# Altium schematic sheet WL_RF_SWITCH.SchDoc
size 420 x 297 mm; SheetNumber: 6; SheetTotal: 9
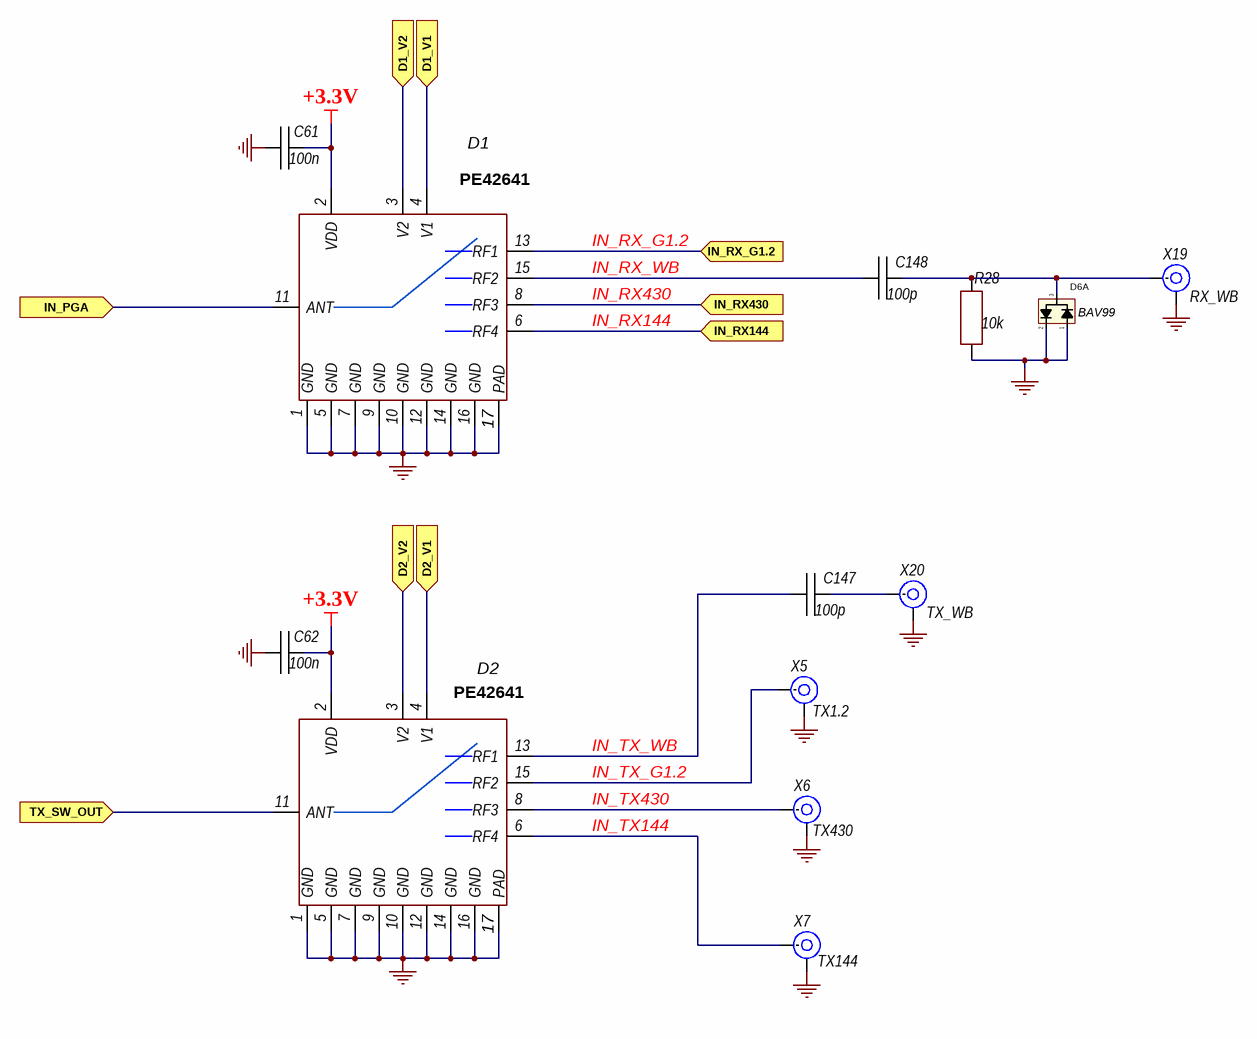
[diagram p0: WL_RF_SWITCH.SchDoc]

## Parts
C61  100n  [CH0805C]
C62  100n  [CH0805C]
C147  100p  [CH0805C]
C148  100p  [CH0805C]
D1  PE42641  [16-QFN (3x3)]
D2  PE42641  [16-QFN (3x3)]
D6  BAV99  [SOT23_132]  (part A of 2)
R28  10k  [CH0805R]
X5  TX1.2  [CON: u.Fl]
X6  TX430  [CON: u.Fl]
X7  TX144  [CON: u.Fl]
X19  RX_WB  [CON: u.Fl]
X20  TX_WB  [CON: u.Fl]

## Ports
D1_V1 (in), D1_V2 (in), D2_V1 (in), D2_V2 (in), IN_PGA (in), IN_RX144 (in), IN_RX430 (in), IN_RX_G1.2 (in), TX_SW_OUT (in)

## Nets
+3.3V: C61.1 C62.1 D1.2(VDD) D2.2(VDD)
GND: C61.2 C62.2 D1.1(GND) D1.5(GND) D1.7(GND) D1.9(GND) D1.10(GND) D1.12(GND) D1.14(GND) D1.16(GND) D1.17(PAD) D2.1(GND) D2.5(GND) D2.7(GND) D2.9(GND) D2.10(GND) D2.12(GND) D2.14(GND) D2.16(GND) D2.17(PAD) D6.1 D6.2 R28.1 X5.2(IN) X6.2(IN) X7.2(IN) X19.2(IN) X20.2(IN)
D1_V1: D1.4(V1) ; port D1_V1
D1_V2: D1.3(V2) ; port D1_V2
D2_V1: D2.4(V1) ; port D2_V1
D2_V2: D2.3(V2) ; port D2_V2
IN_PGA: D1.11(ANT) ; port IN_PGA
IN_RX144: D1.6(RF4) ; port IN_RX144
IN_RX430: D1.8(RF3) ; port IN_RX430
IN_RX_G1.2: D1.13(RF1) ; port IN_RX_G1.2
IN_RX_WB: C148.1 D1.15(RF2)
IN_TX144: D2.6(RF4) X7.1(IN)
IN_TX430: D2.8(RF3) X6.1(IN)
IN_TX_G1.2: D2.15(RF2) X5.1(IN)
IN_TX_WB: C147.1 D2.13(RF1)
TX_SW_OUT: D2.11(ANT) ; port TX_SW_OUT
NetC147_2: C147.2 X20.1(IN)
NetC148_2: C148.2 D6.3 R28.2 X19.1(IN)

## Notes on the sheet
- Подп. и дата
- Инв. № дубл.
- Взам. инв. №
- Инв. № подл.
- Лист
- Изм.
- № докум.
- Подп.
- Дата
- Копировал
- Формат А3

## Library data of the parts
C61 C62 C147 C148 = Capacitor: Manufacturer: *; Model: *; HelpURL: *; ComponentKind: *; Value: *
R28 = Resistor: Manufacturer: *; Model: *; HelpURL: *; ComponentKind: *; Value: *
X5-X7 X19 X20 = SMA: RF; Model: *; Manufacturer: *; HelpURL: *; ComponentKind: *